# Altium project lv_controller.PrjPcb
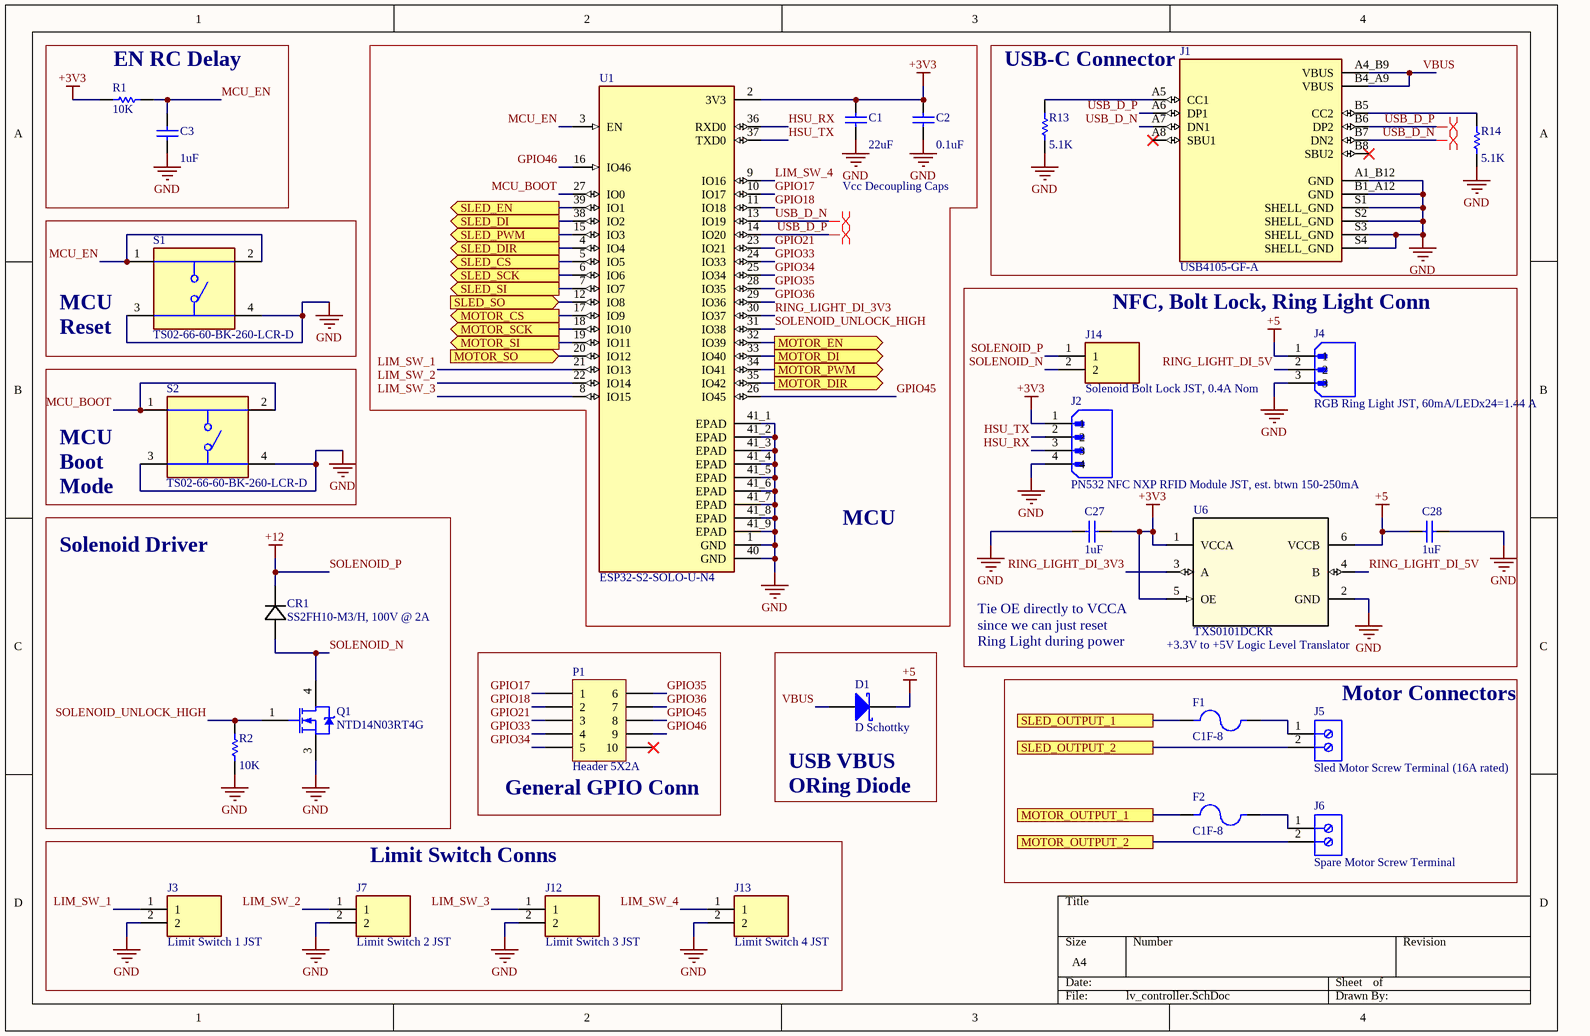
[diagram p0: lv_controller.SchDoc]
3 sheets, 72 parts. Net scope: flat (ports and power ports of the same name join across sheets).
Board file: lv_controller.PcbDoc
Sheets:
  lv_controller.SchDoc
  lv_controller_power.SchDoc
  lv_controller_motor_drivers.SchDoc

## Sheet lv_controller.SchDoc
size A4; SheetNumber: 1; SheetTotal: 3; SPICEModelCacheMFLOWQJR: <root> / <DocumentId>MFLOWQJR</DocumentId> / <CacheFrame Number="0"> / <Model Name="skydiode" Kind="MDL"> / <Text>*Default Schottky Diode / *Schottky Diode Pinout: A,K / .MODEL SKYDIODE D(EG=0.69 XTI=2)</Text> / </Model> / </CacheFrame> / </root>

### Parts
C1  value 22uF  [C0805]  (hidden comment: Cap)
C2  value 0.1uF  [C0805]  (hidden comment: Cap)
C3  value 1uF  [C0805]  (hidden comment: Cap)
C27  value 1uF  [C0805]  (hidden comment: Cap)
C28  value 1uF  [C0805]  (hidden comment: Cap)
CR1  SS2FH10-M3/H, 100V @ 2A  [CR_10-M3/H_VIS]
D1  D Schottky  [SODFL4725X110N]
F1  C1F-8  [FUSC3215X83N]
F2  C1F-8  [FUSC3215X83N]
J1  USB4105-GF-A  [GCT_USB4105-GF-A]
J2  PN532 NFC NXP RFID Module JST, est. btwn 150-250mA  [JST_B4B-XH-A(LF)(SN)]
J3  Limit Switch 1 JST  [JST_B2B-XH-A(LF)(SN)]
J4  RGB Ring Light JST, 60mA/LEDx24=1.44 A  [JST_B3B-XH-A(LF)(SN)]
J5  Sled Motor Screw Terminal (16A rated)  [PHOE-1725656-2]
J6  Spare Motor Screw Terminal  [PHOE-1725656-2]
J7  Limit Switch 2 JST  [JST_B2B-XH-A(LF)(SN)]
J12  Limit Switch 3 JST  [JST_B2B-XH-A(LF)(SN)]
J13  Limit Switch 4 JST  [JST_B2B-XH-A(LF)(SN)]
J14  Solenoid Bolt Lock JST, 0.4A Nom  [JST_B2B-XH-A(LF)(SN)]
P1  Header 5X2A  [HDR2X5_CEN]
Q1  NTD14N03RT4G  [ONSC-DPAK-3-369C-01_V]
R1  value 10K  [6-0805_M]  (hidden comment: Res1)
R2  value 10K  [6-0805_M]  (hidden comment: Res1)
R13  value 5.1K  [6-0805_M]  (hidden comment: Res1)
R14  value 5.1K  [6-0805_M]  (hidden comment: Res1)
S1  TS02-66-60-BK-260-LCR-D  [SW_TS02-66-60-BK-260-LCR-D]
S2  TS02-66-60-BK-260-LCR-D  [SW_TS02-66-60-BK-260-LCR-D]
U1  ESP32-S2-SOLO-U-N4  [XCVR_ESP32-S2-SOLO-U-N4R2]
U6  TXS0101DCKR  [DCK0006A_N]

### Blocks framed on the sheet
EN RC Delay: C3 R1
MCU: C1 C2 U1
USB-C Connector: J1 R13 R14
NFC, Bolt Lock, Ring Light Conn: C27 C28 J2 J4 J14 U6
Solenoid Driver: CR1 Q1 R2
General GPIO Conn: P1
Motor Connectors: F1 F2 J5 J6
Limit Switch Conns: J3 J7 J12 J13

### Ports
MOTOR_CS (out, see lv_controller_motor_drivers[1C]), MOTOR_DI (out, see lv_controller_motor_drivers[1D]), MOTOR_DIR (out, see lv_controller_motor_drivers[1C]), MOTOR_EN (out, see lv_controller_motor_drivers[1C]), MOTOR_OUTPUT_1 (see lv_controller_motor_drivers[2C]), MOTOR_OUTPUT_2 (see lv_controller_motor_drivers[2C]), MOTOR_PWM (out, see lv_controller_motor_drivers[1C]), MOTOR_SCK (out, see lv_controller_motor_drivers[1C]), MOTOR_SI (out, see lv_controller_motor_drivers[1C]), MOTOR_SO (in, see lv_controller_motor_drivers[1C]), SLED_CS (out, see lv_controller_motor_drivers[2A]), SLED_DI (out, see lv_controller_motor_drivers[2B]), SLED_DIR (out, see lv_controller_motor_drivers[2B]), SLED_EN (out, see lv_controller_motor_drivers[2B]), SLED_OUTPUT_1 (see lv_controller_motor_drivers[4A]), SLED_OUTPUT_2 (see lv_controller_motor_drivers[4A]), SLED_PWM (out, see lv_controller_motor_drivers[2B]), SLED_SCK (out, see lv_controller_motor_drivers[2A]), SLED_SI (out, see lv_controller_motor_drivers[2A]), SLED_SO (in, see lv_controller_motor_drivers[2A])

### Nets
+3V3: C1.2 C2.2 C27.1 J2.1 R1.1 U1.2(3V3) U6.1(VCCA) U6.5(OE)
+5: C28.2 D1.2(K) J4.1 U6.6(VCCB)
GND: C1.1 C2.1 C3.1 C27.2 C28.1 J1.A1_B12(GND) J1.B1_A12(GND) J1.S1(SHELL_GND) J1.S2(SHELL_GND) J1.S3(SHELL_GND) J1.S4(SHELL_GND) J2.4 J3.2 J4.3 J7.2 J12.2 J13.2 Q1.3(S) R2.2 R13.1 R14.1 S1.3 S1.4 S2.3 S2.4 U1.1(GND) U1.40(GND) U1.41_1(EPAD) U1.41_2(EPAD) U1.41_3(EPAD) U1.41_4(EPAD) U1.41_5(EPAD) U1.41_6(EPAD) U1.41_7(EPAD) U1.41_8(EPAD) U1.41_9(EPAD) U6.2(GND)
SOLENOID_P: CR1.1 J14.1  [also labelled +12]
GPIO17: P1.1 U1.10(IO17)
GPIO18: P1.2 U1.11(IO18)
GPIO21: P1.3 U1.23(IO21)
GPIO33: P1.4 U1.24(IO33)
GPIO34: P1.5 U1.25(IO34)
GPIO35: P1.6 U1.28(IO35)
GPIO36: P1.7 U1.29(IO36)
GPIO45: P1.8 U1.26(IO45)
GPIO46: P1.9 U1.16(IO46)
HSU_RX: J2.3 U1.36(RXD0)
HSU_TX: J2.2 U1.37(TXD0)
LIM_SW_1: J3.1 U1.21(IO13)
LIM_SW_2: J7.1 U1.22(IO14)
LIM_SW_3: J12.1 U1.8(IO15)
LIM_SW_4: J13.1 U1.9(IO16)
MCU_BOOT: S2.1 S2.2 U1.27(IO0)
MCU_EN: C3.2 R1.2 S1.1 S1.2 U1.3(EN)
RING_LIGHT_DI_3V3: U1.30(IO37) U6.3(A)
RING_LIGHT_DI_5V: J4.2 U6.4(B)
SOLENOID_N: CR1.2 J14.2 Q1.4(D)
SOLENOID_UNLOCK_HIGH: Q1.1(G) R2.1 U1.31(IO38)
USB_D_N: J1.A7(DN1) J1.B7(DN2) U1.13(IO19)
USB_D_P: J1.A6(DP1) J1.B6(DP2) U1.14(IO20)
VBUS: D1.1(A) J1.A4_B9(VBUS) J1.B4_A9(VBUS)
NetC18_2: F1.1 ; port SLED_OUTPUT_1
NetC19_2: J5.2 ; port SLED_OUTPUT_2
NetC24_2: F2.1 ; port MOTOR_OUTPUT_1
NetC25_2: J6.2 ; port MOTOR_OUTPUT_2
NetF1_2: F1.2 J5.1
NetF2_2: F2.2 J6.1
NetJ1_A5: J1.A5(CC1) R13.2
NetJ1_B5: J1.B5(CC2) R14.2
NetR7_2: U1.38(IO2) ; port SLED_DI
NetR8_1: U1.39(IO1) ; port SLED_EN
NetR10_2: U1.33(IO40) ; port MOTOR_DI
NetR11_1: U1.32(IO39) ; port MOTOR_EN
NetU1_4: U1.4(IO4) ; port SLED_DIR
NetU1_5: U1.5(IO5) ; port SLED_CS
NetU1_6: U1.6(IO6) ; port SLED_SCK
NetU1_7: U1.7(IO7) ; port SLED_SI
NetU1_12: U1.12(IO8) ; port SLED_SO
NetU1_15: U1.15(IO3) ; port SLED_PWM
NetU1_17: U1.17(IO9) ; port MOTOR_CS
NetU1_18: U1.18(IO10) ; port MOTOR_SCK
NetU1_19: U1.19(IO11) ; port MOTOR_SI
NetU1_20: U1.20(IO12) ; port MOTOR_SO
NetU1_34: U1.34(IO41) ; port MOTOR_PWM
NetU1_35: U1.35(IO42) ; port MOTOR_DIR

Not connected (* = marked no-connect by the designer): J1 A8(SBU1)* B8(SBU2)*; P1 10*

### Layout directives
differential pair: USB_D_N, USB_D_P

### Notes on the sheet
- Vcc Decoupling Caps
- (near S1) MCU Reset
- (near S2) MCU Boot Mode
- Tie OE directly to VCCA since we can just reset Ring Light during power up
- (near U6) +3.3V to +5V Logic Level Translator
- (near D1) USB VBUS
  ORing Diode

### Library data of the parts
C1-C3 C27 C28 = Cap: Capacitor; Published: 8-Jun-2000; LatestRevisionDate: 17-Jul-2002; LatestRevisionNote: Re-released for DXP Platform.; PackageReference: RAD-0.3; Publisher: Altium Limited; PackageDescription: Radial Cap, Thru-Hole; 2 Leads; 0.3 in Pin Spacing
CR1 = SS2FH10-M3/H: No Description Available; Mfr_Name: Vishay; Type: DEV; Copyright: Copyright (C) 2022 Ultra Librarian. All rights reserved.; Manufacturer_Part_Number: SS2FH10-M3/H; RefDes: RefDes
D1 = D Schottky: Schottky Diode; Published: 8-Jun-2000; LatestRevisionDate: 17-Jul-2002; LatestRevisionNote: Re-released for DXP Platform.; PackageReference: SMB; Publisher: Altium Limited; PackageDescription: DO-214-AA/SMB; 2 C-Bend Leads; Body 5.3 x 3.6 mm, inc. leads (LxW); Code_JEDEC: DO-214-AA
F1 F2 = C1F-8: C1F 8 (0685F8000-01) | 1206 SMT Fuse | Fast Acting | 8A; MF: Bel Fuse; Availability: Unavailable; Value: *; Price: None; MP: C1F-8; Package: 1206 Bel Fuse; SnapEDA_Link: https://www.snapeda.com/parts/C1F-8/Bel%20Fuse/view-part/4620009/?ref=snap; Check_prices: https://www.snapeda.com/parts/C1F-8/Bel%20Fuse/view-part/4620009/?ref=eda
J1 = USB4105-GF-A: USB-C (USB TYPE-C) USB 2.0 Receptacle Connector 24 (16+8 Dummy) Position Surface Mount, Right Angle; Through Hole; MF: GCT; Price: None; Availability: In Stock; MP: USB4105-GF-A; Package: None; SnapEDA_Link: https://www.snapeda.com/parts/USB4105-GF-A/Global+Connector+Technology/view-part/?ref=snap; Check_prices: https://www.snapeda.com/parts/USB4105-GF-A/Global+Connector+Technology/view-part/?ref=eda; Value: *; Purchase-URL: https://pricing.snapeda.com/search/part/USB4105-GF-A/?ref=eda
J2 = B4B-XH-A(LF)(SN): Price: None; MP: B4B-XH-A(LF)(SN); Value: *; Availability: Unavailable; Package: None
J3 J7 J12-J14 = B2B-XH-A(LF)(SN): Connector Header Through Hole 2 position 0.098 (2.50mm); MF: JST Sales; MP: B2B-XH-A(LF)(SN); Package: None; SnapEDA_Link: https://www.snapeda.com/parts/B2B-XH-A(LF)(SN)/JST+Sales+America+Inc./view-part/?ref=snap; Purchase-URL: https://pricing.snapeda.com/search/part/B2B-XH-A(LF)(SN)/?ref=eda; Check_prices: https://www.snapeda.com/parts/B2B-XH-A(LF)(SN)/JST+Sales+America+Inc./view-part/?ref=eda; Availability: In Stock; Value: *; Price: None
J4 = B3B-XH-A(LF)(SN): Value: *; MP: B3B-XH-A(LF)(SN); Availability: Unavailable; Package: None; Price: None
J5 J6 = CMP-2000-05299-1: Male Header, Pitch 2.54 mm, 1 x 2 Position, Height 9 mm, Tail Length 3.5 mm; Manufacturer part No.: 1725656; Manufacturer: Phoenix Contact; Number of contacts: 2; Content: 250pc(s); Pitch: 2.54mm; Industrial packaging: Yes; Colour: Green; Type: MPT0,5/2-2,54; Datasheet URL: http://datasheet.octopart.com/1725656-Phoenix-Contact-datasheet-5302866.pdf; Manufacturer URL: http://www.phoenixcontact.com/; Datasheet Version: Apr-08
P1 = Header 5X2A: Header, 5-Pin, Dual row; LatestRevisionDate: 17-Jul-2002; LatestRevisionNote: Re-released for DXP Platform.; Publisher: Altium Limited
Q1 = CMP-1058-00361-1: Power MOSFET, 14 A, 25 V, N-Channel, 3-Pin DPAK, Pb-Free, Tape and Reel; Manufacturer: On Semiconductor; Configuration: Single; Ciss Typ (pF): 115; Coss Typ (pF): 62; VGS(th) Max (V): 2; Channel Polarity: N Channel; Crss Typ (pF): 33; V(BR)DSS Min (V): 25; VGS Max (V): 20; PackageVersion: Rev. E, 02/2014; RoHS: Pb-Free; ComponentLink2URL: http://www.onsemi.cn/pub_link/Collateral/NTD14N03R-D.PDF; ComponentLink1URL: http://www.onsemi.com/; PackageDescription: 3-Pin Flange Mount, Body 6.54 x 6.095 mm, Pitch 2.29 mm; Package Type: DPAK-3; ComponentLink1Description: Manufacturer URL; Qrr Typ (nC): 2; ComponentLink3URL: http://www.onsemi.cn/pub_link/Collateral/369C.PDF; PackageReference: DPAK-3-369C-01; ComponentLink2Description: Datasheet; DatasheetVersion: Rev. 7; Mounting Technology: Surface Mount; ComponentLink3Description: Package Specification; PartNumber: NTD14N03RT4G; Packing: Tape and Reel
R1 R2 R13 R14 = Res1: Resistor; Published: 8-Jun-2000; LatestRevisionDate: 17-Jul-2002; LatestRevisionNote: Re-released for DXP Platform.; PackageReference: AXIAL-0.3; Publisher: Altium Limited; PackageDescription: Axial Device, Thru-Hole; 2 Leads; 0.3 in Pin Spacing
S1 S2 = TS02-66-60-BK-260-LCR-D: 6 x 6 mm, 6 mm Actuator Height, 260 gf, Black, Long Crimped, Through Hole, SPST, Tactile Switch; MF: CUI Devices; Check_prices: https://www.snapeda.com/parts/TS02-66-60-BK-260-LCR-D/CUI+Devices/view-part/?ref=eda; Price: None; SnapEDA_Link: https://www.snapeda.com/parts/TS02-66-60-BK-260-LCR-D/CUI+Devices/view-part/?ref=snap; Availability: In Stock; Value: *; CUI_purchase_URL: https://www.cuidevices.com/product/switches/tactile-switches/ts02-series?utm_source=snapeda.com&utm_medium=referral&utm_campaign=snapedaBOM; MP: TS02-66-60-BK-260-LCR-D; Purchase-URL: https://pricing.snapeda.com/search/part/TS02-66-60-BK-260-LCR-D/?ref=eda; Package: None
U1 = ESP32-S2-SOLO-U-N4R2: WiFi 802.11b/g/n Transceiver Module 2.4GHz PCB Trace + IPEX Surface Mount; MF: Espressif Systems; Package: SMD-40 Espressif Systems; Check_prices: https://www.snapeda.com/parts/ESP32-S2-SOLO-U-N4R2/Espressif+Systems/view-part/?ref=eda; Availability: In Stock; Value: *; MP: ESP32-S2-SOLO-U-N4R2; Purchase-URL: https://pricing.snapeda.com/search/part/ESP32-S2-SOLO-U-N4R2/?ref=eda; SnapEDA_Link: https://www.snapeda.com/parts/ESP32-S2-SOLO-U-N4R2/Espressif+Systems/view-part/?ref=snap; Price: None
U6 = TXS0101DCKR: No Description Available; Mfr_Name: Texas Instruments; Type: DEV; RefDes: RefDes; Copyright: Copyright (C) 2022 Ultra Librarian. All rights reserved.; Manufacturer_Part_Number: TXS0101DCKR

## Sheet lv_controller_power.SchDoc
size A4; SheetNumber: 2; SheetTotal: 3
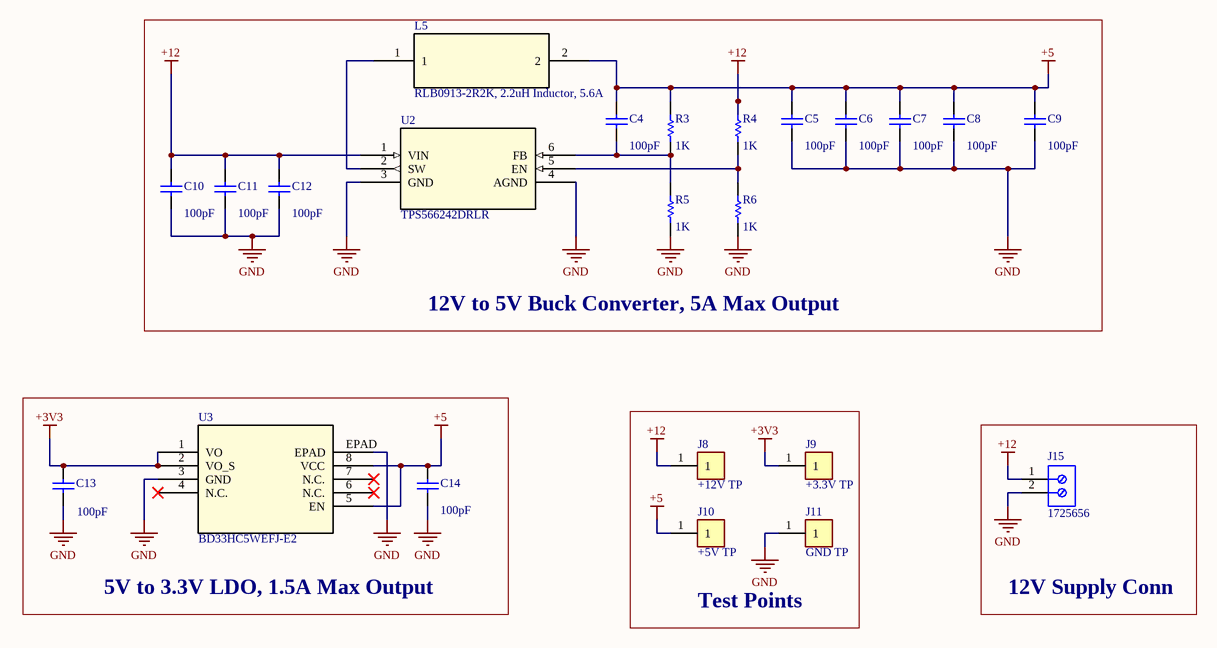
[diagram p1: lv_controller_power.SchDoc]

### Parts
C4  value 100pF  [C0805]  (hidden comment: Cap)
C5  value 100pF  [C0805]  (hidden comment: Cap)
C6  value 100pF  [C0805]  (hidden comment: Cap)
C7  value 100pF  [C0805]  (hidden comment: Cap)
C8  value 100pF  [C0805]  (hidden comment: Cap)
C9  value 100pF  [C0805]  (hidden comment: Cap)
C10  value 100pF  [C0805]  (hidden comment: Cap)
C11  value 100pF  [C0805]  (hidden comment: Cap)
C12  value 100pF  [C0805]  (hidden comment: Cap)
C13  value 100pF  [C0805]  (hidden comment: Cap)
C14  value 100pF  [C0805]  (hidden comment: Cap)
J8  +12V TP  [KEYSTONE_5000]
J9  +3.3V TP  [KEYSTONE_5000]
J10  +5V TP  [KEYSTONE_5000]
J11  GND TP  [KEYSTONE_5000]
J15  1725656  [PHOE-1725656-2]
L5  RLB0913-2R2K, 2.2uH Inductor, 5.6A  [RLB0913-4R7K_BRN]
R3  value 1K  [6-0805_M]  (hidden comment: Res1)
R4  value 1K  [6-0805_M]  (hidden comment: Res1)
R5  value 1K  [6-0805_M]  (hidden comment: Res1)
R6  value 1K  [6-0805_M]  (hidden comment: Res1)
U2  TPS566242DRLR  [SOT5x3_DRL_TEX]
U3  BD33HC5WEFJ-E2  [HTSOP-J8_ROM]

### Blocks framed on the sheet
12V to 5V Buck Converter, 5A Max Output: C4-C12 L5 R3-R6 U2
5V to 3.3V LDO, 1.5A Max Output: C13 C14 U3
Test Points: J8-J11
12V Supply Conn: J15

### Nets
+3V3: C13.2 J9.1 U3.1(VO) U3.2(VO_S)
+5: C4.2 C5.2 C6.2 C7.2 C8.2 C9.2 C14.2 J10.1 L5.2 R3.1 U3.5(EN) U3.8(VCC)
+12: C10.2 C11.2 C12.2 J8.1 J15.1 R4.1 U2.1(VIN)  [project net SOLENOID_P]
GND: C5.1 C6.1 C7.1 C8.1 C9.1 C10.1 C11.1 C12.1 C13.1 C14.1 J11.1 J15.2 R5.2 R6.2 U2.3(GND) U2.4(AGND) U3.3(GND) U3.EPAD
NetC4_1: C4.1 R3.2 R5.1 U2.6(FB)
NetL5_1: L5.1 U2.2(SW)
NetR4_2: R4.2 R6.1 U2.5(EN)

Not connected (* = marked no-connect by the designer): U3 4(N.C.)* 6(N.C.)* 7(N.C.)*

### Library data of the parts
C4-C14 = Cap: Capacitor; Published: 8-Jun-2000; LatestRevisionDate: 17-Jul-2002; LatestRevisionNote: Re-released for DXP Platform.; PackageReference: RAD-0.3; Publisher: Altium Limited; PackageDescription: Radial Cap, Thru-Hole; 2 Leads; 0.3 in Pin Spacing
J8-J11 = 5000: High Pin Count, Backplane Connectors, Receptacle, Right Angle, Through Hole, 4 Row, 120 Positions, 0 Guide Pin, 2.54mm (0.100in) Pitch; MF: Keystone; MP: 5000; Package: Custom Package Ohmite; Availability: Good; Price: None; Purchase-URL: https://pricing.snapeda.com/search/part/5000/?ref=eda; SnapEDA_Link: https://www.snapeda.com/parts/5000/Keystone/view-part/883846/?ref=snap; Value: *; Check_prices: https://www.snapeda.com/parts/5000/Keystone/view-part/883846/?ref=eda
J15 = CMP-2000-05299-1: Male Header, Pitch 2.54 mm, 1 x 2 Position, Height 9 mm, Tail Length 3.5 mm; Manufacturer: Phoenix Contact; Number of contacts: 2; Content: 250pc(s); Pitch: 2.54mm; Industrial packaging: Yes; Colour: Green; Manufacturer part No.: 1725656; Type: MPT0,5/2-2,54; Datasheet URL: http://datasheet.octopart.com/1725656-Phoenix-Contact-datasheet-5302866.pdf; Manufacturer URL: http://www.phoenixcontact.com/; Datasheet Version: Apr-08
L5 = RLB0913-4R7K: No Description Available; Mfr_Name: Bourns Electronics; Type: DEV; Copyright: Copyright (C) 2022 Ultra Librarian. All rights reserved.; Manufacturer_Part_Number: RLB0913-4R7K; RefDes: RefDes
R3-R6 = Res1: Resistor; Published: 8-Jun-2000; LatestRevisionDate: 17-Jul-2002; LatestRevisionNote: Re-released for DXP Platform.; PackageReference: AXIAL-0.3; Publisher: Altium Limited; PackageDescription: Axial Device, Thru-Hole; 2 Leads; 0.3 in Pin Spacing
U2 = TPS566242DRLR: No Description Available; Mfr_Name: Texas Instruments; Copyright: Copyright (C) 2022 Ultra Librarian. All rights reserved.; Manufacturer_Part_Number: TPS566242DRLR; RefDes: RefDes; Type: DEV
U3 = BD33HC5WEFJ-E2: No Description Available; Mfr_Name: ROHM Semiconductor; Copyright: Copyright (C) 2022 Ultra Librarian. All rights reserved.; Manufacturer_Part_Number: BD33HC5WEFJ-E2; RefDes: RefDes; Type: DEV

## Sheet lv_controller_motor_drivers.SchDoc
size A4; SheetNumber: 3; SheetTotal: 3
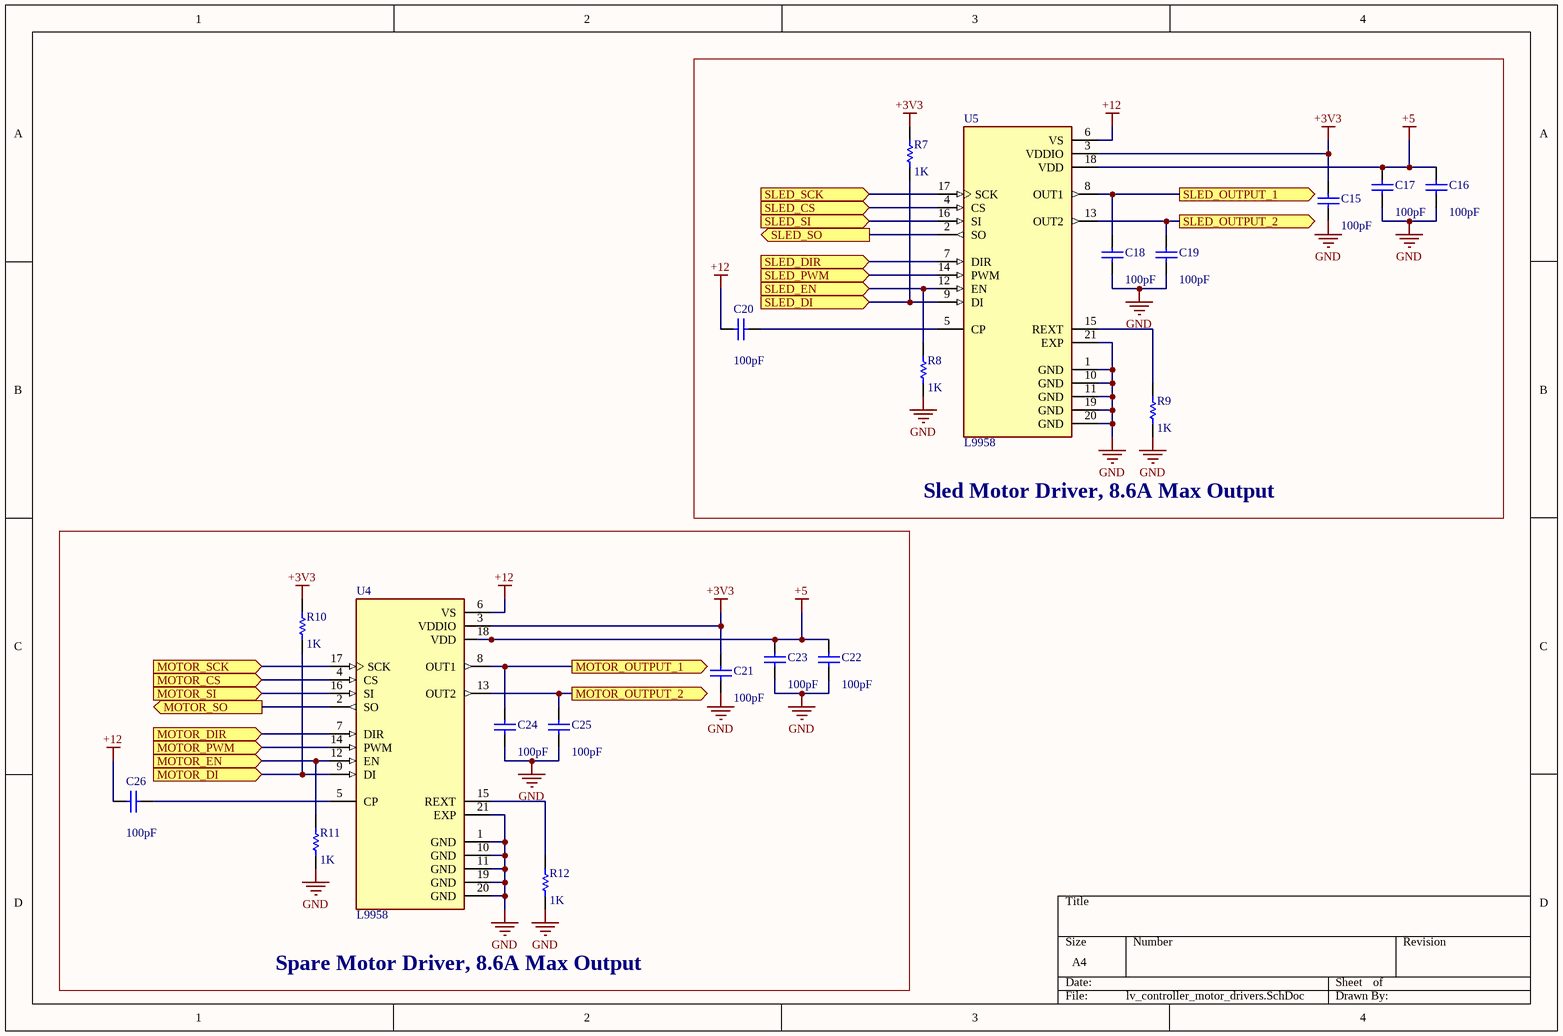
[diagram p2: lv_controller_motor_drivers.SchDoc]

### Parts
C15  value 100pF  [C0805]  (hidden comment: Cap)
C16  value 100pF  [C0805]  (hidden comment: Cap)
C17  value 100pF  [C0805]  (hidden comment: Cap)
C18  value 100pF  [C0805]  (hidden comment: Cap)
C19  value 100pF  [C0805]  (hidden comment: Cap)
C20  value 100pF  [C0805]  (hidden comment: Cap)
C21  value 100pF  [C0805]  (hidden comment: Cap)
C22  value 100pF  [C0805]  (hidden comment: Cap)
C23  value 100pF  [C0805]  (hidden comment: Cap)
C24  value 100pF  [C0805]  (hidden comment: Cap)
C25  value 100pF  [C0805]  (hidden comment: Cap)
C26  value 100pF  [C0805]  (hidden comment: Cap)
R7  value 1K  [6-0805_M]  (hidden comment: Res1)
R8  value 1K  [6-0805_M]  (hidden comment: Res1)
R9  value 1K  [6-0805_M]  (hidden comment: Res1)
R10  value 1K  [6-0805_M]  (hidden comment: Res1)
R11  value 1K  [6-0805_M]  (hidden comment: Res1)
R12  value 1K  [6-0805_M]  (hidden comment: Res1)
U4  L9958  [SOIC127P1420X360-21N]
U5  L9958  [SOIC127P1420X360-21N]

### Blocks framed on the sheet
Sled Motor Driver, 8.6A Max Output: C15-C20 R7-R9 U5
Spare Motor Driver, 8.6A Max Output: C21-C26 R10-R12 U4

### Ports
MOTOR_CS (in, see lv_controller[2B]), MOTOR_DI (in, see lv_controller[2B]), MOTOR_DIR (in, see lv_controller[2B]), MOTOR_EN (in, see lv_controller[2B]), MOTOR_OUTPUT_1 (out, see lv_controller[3D]), MOTOR_OUTPUT_2 (out, see lv_controller[3D]), MOTOR_PWM (in, see lv_controller[2B]), MOTOR_SCK (in, see lv_controller[2B]), MOTOR_SI (in, see lv_controller[2B]), MOTOR_SO (out, see lv_controller[2B]), SLED_CS (in, see lv_controller[2B]), SLED_DI (in, see lv_controller[2A]), SLED_DIR (in, see lv_controller[2A]), SLED_EN (in, see lv_controller[2A]), SLED_OUTPUT_1 (out, see lv_controller[3C]), SLED_OUTPUT_2 (out, see lv_controller[3C]), SLED_PWM (in, see lv_controller[2A]), SLED_SCK (in, see lv_controller[2B]), SLED_SI (in, see lv_controller[2B]), SLED_SO (out, see lv_controller[2B])

### Nets
+3V3: C15.2 C21.2 R7.1 R10.1 U4.3(VDDIO) U5.3(VDDIO)
+5: C16.2 C17.2 C22.2 C23.2 U4.18(VDD) U5.18(VDD)
+12: C20.1 C26.1 U4.6(VS) U5.6(VS)  [project net SOLENOID_P]
GND: C15.1 C16.1 C17.1 C18.1 C19.1 C21.1 C22.1 C23.1 C24.1 C25.1 R8.2 R9.2 R11.2 R12.2 U4.1(GND) U4.10(GND) U4.11(GND) U4.19(GND) U4.20(GND) U4.21(EXP) U5.1(GND) U5.10(GND) U5.11(GND) U5.19(GND) U5.20(GND) U5.21(EXP)
NetC18_2: C18.2 U5.8(OUT1) ; port SLED_OUTPUT_1
NetC19_2: C19.2 U5.13(OUT2) ; port SLED_OUTPUT_2
NetC20_2: C20.2 U5.5(CP)
NetC24_2: C24.2 U4.8(OUT1) ; port MOTOR_OUTPUT_1
NetC25_2: C25.2 U4.13(OUT2) ; port MOTOR_OUTPUT_2
NetC26_2: C26.2 U4.5(CP)
NetR7_2: R7.2 U5.9(DI) ; port SLED_DI
NetR8_1: R8.1 U5.12(EN) ; port SLED_EN
NetR9_1: R9.1 U5.15(REXT)
NetR10_2: R10.2 U4.9(DI) ; port MOTOR_DI
NetR11_1: R11.1 U4.12(EN) ; port MOTOR_EN
NetR12_1: R12.1 U4.15(REXT)
NetU1_4: U5.7(DIR) ; port SLED_DIR
NetU1_5: U5.4(CS) ; port SLED_CS
NetU1_6: U5.17(SCK) ; port SLED_SCK
NetU1_7: U5.16(SI) ; port SLED_SI
NetU1_12: U5.2(SO) ; port SLED_SO
NetU1_15: U5.14(PWM) ; port SLED_PWM
NetU1_17: U4.4(CS) ; port MOTOR_CS
NetU1_18: U4.17(SCK) ; port MOTOR_SCK
NetU1_19: U4.16(SI) ; port MOTOR_SI
NetU1_20: U4.2(SO) ; port MOTOR_SO
NetU1_34: U4.14(PWM) ; port MOTOR_PWM
NetU1_35: U4.7(DIR) ; port MOTOR_DIR

### Library data of the parts
C15-C26 = Cap: Capacitor; Published: 8-Jun-2000; LatestRevisionDate: 17-Jul-2002; LatestRevisionNote: Re-released for DXP Platform.; PackageReference: RAD-0.3; Publisher: Altium Limited; PackageDescription: Radial Cap, Thru-Hole; 2 Leads; 0.3 in Pin Spacing
R7-R12 = Res1: Resistor; Published: 8-Jun-2000; LatestRevisionDate: 17-Jul-2002; LatestRevisionNote: Re-released for DXP Platform.; PackageReference: AXIAL-0.3; Publisher: Altium Limited; PackageDescription: Axial Device, Thru-Hole; 2 Leads; 0.3 in Pin Spacing
U4 U5 = L9958: Bipolar Motor Driver CMOS SPI PowerSO-16â„¢; MF: STMicroelectronics; SnapEDA_Link: https://www.snapeda.com/parts/L9958/STMicroelectronics/view-part/213961/?ref=snap; Availability: Unavailable; MP: L9958; Package: SO-20 STMicroelectronics; Price: None; Value: *

## Nets that join several sheets
+3V3: lv_controller (8 pins), lv_controller_power (C13.2 J9.1 U3.1 U3.2), lv_controller_motor_drivers (6 pins)
+5: lv_controller (C28.2 D1.2 J4.1 U6.6), lv_controller_power (12 pins), lv_controller_motor_drivers (6 pins)
GND: lv_controller (37 pins), lv_controller_power (18 pins), lv_controller_motor_drivers (26 pins)
SOLENOID_P: lv_controller (CR1.1 J14.1), lv_controller_power (7 pins), lv_controller_motor_drivers (C20.1 C26.1 U4.6 U5.6)
NetC18_2: lv_controller (F1.1), lv_controller_motor_drivers (C18.2 U5.8)
NetC19_2: lv_controller (J5.2), lv_controller_motor_drivers (C19.2 U5.13)
NetC24_2: lv_controller (F2.1), lv_controller_motor_drivers (C24.2 U4.8)
NetC25_2: lv_controller (J6.2), lv_controller_motor_drivers (C25.2 U4.13)
NetR7_2: lv_controller (U1.38), lv_controller_motor_drivers (R7.2 U5.9)
NetR8_1: lv_controller (U1.39), lv_controller_motor_drivers (R8.1 U5.12)
NetR10_2: lv_controller (U1.33), lv_controller_motor_drivers (R10.2 U4.9)
NetR11_1: lv_controller (U1.32), lv_controller_motor_drivers (R11.1 U4.12)
NetU1_4: lv_controller (U1.4), lv_controller_motor_drivers (U5.7)
NetU1_5: lv_controller (U1.5), lv_controller_motor_drivers (U5.4)
NetU1_6: lv_controller (U1.6), lv_controller_motor_drivers (U5.17)
NetU1_7: lv_controller (U1.7), lv_controller_motor_drivers (U5.16)
NetU1_12: lv_controller (U1.12), lv_controller_motor_drivers (U5.2)
NetU1_15: lv_controller (U1.15), lv_controller_motor_drivers (U5.14)
NetU1_17: lv_controller (U1.17), lv_controller_motor_drivers (U4.4)
NetU1_18: lv_controller (U1.18), lv_controller_motor_drivers (U4.17)
NetU1_19: lv_controller (U1.19), lv_controller_motor_drivers (U4.16)
NetU1_20: lv_controller (U1.20), lv_controller_motor_drivers (U4.2)
NetU1_34: lv_controller (U1.34), lv_controller_motor_drivers (U4.14)
NetU1_35: lv_controller (U1.35), lv_controller_motor_drivers (U4.7)